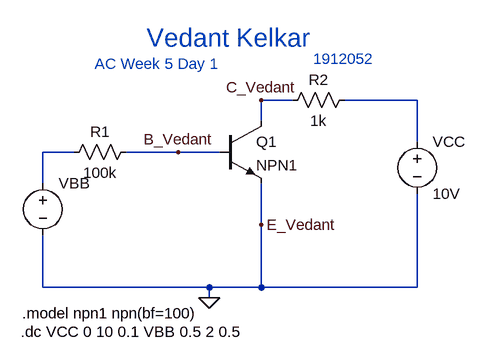
[diagram p0: schematic Draft22.asc]
Draft22.asc, the LTspice schematic file:
Version 4
SHEET 1 880 680
WIRE 304 192 256 192
WIRE 496 192 384 192
WIRE 256 224 256 192
WIRE 496 256 496 192
WIRE -32 272 -80 272
WIRE 128 272 48 272
WIRE 192 272 128 272
WIRE -80 320 -80 272
WIRE 256 384 256 320
WIRE -80 480 -80 400
WIRE 176 480 -80 480
WIRE 256 480 256 384
WIRE 256 480 176 480
WIRE 496 480 496 336
WIRE 496 480 256 480
WIRE 176 496 176 480
FLAG 176 496 0
FLAG 256 384 E_Vedant
FLAG 128 272 B_Vedant
FLAG 256 192 C_Vedant
SYMBOL voltage -80 304 R0
WINDOW 123 0 0 Left 0
WINDOW 39 0 0 Left 0
SYMATTR InstName VBB
SYMATTR Value ""
SYMBOL voltage 496 240 R0
SYMATTR InstName VCC
SYMATTR Value 10V
SYMBOL res 64 256 R90
WINDOW 0 0 56 VBottom 2
WINDOW 3 32 56 VTop 2
SYMATTR InstName R1
SYMATTR Value 100k
SYMBOL res 400 176 R90
WINDOW 0 0 56 VBottom 2
WINDOW 3 32 56 VTop 2
SYMATTR InstName R2
SYMATTR Value 1k
SYMBOL npn 192 224 R0
SYMATTR InstName Q1
SYMATTR Value NPN1
TEXT 80 96 Left 4 ;Vedant Kelkar
TEXT 336 128 Left 2 ;1912052
TEXT 0 136 Left 2 ;AC Week 5 Day 1
TEXT -112 520 Left 2 !.model npn1 npn(bf=100)
TEXT -114 548 Left 2 !.dc VCC 0 10 0.1 VBB 0.5 2 0.5

The netlist it stands for:
* Draft22.asc
VBB N002 0
VCC N001 0 10V
R1 B_Vedant N002 100k
R2 N001 C_Vedant 1k
Q1 C_Vedant B_Vedant 0 0 NPN1
.model NPN NPN
.model PNP PNP
.lib standard.bjt
* Vedant Kelkar
* 1912052
* AC Week 5 Day 1
.model npn1 npn(bf=100)
.dc VCC 0 10 0.1 VBB 0.5 2 0.5
.backanno
.end